# EAGLE design Adafruit VEML6070 (EAGLE 9.4.2)
AUTHOR: KTOWN
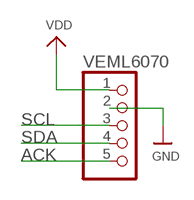
[diagram p0: schematic, sheet 1]

## Parts
VEML6070  HEADER-1X570MIL  [1X05_ROUND_70]

## Nets
ACK: VEML6070.5
GND: VEML6070.2
SCL: VEML6070.3
SDA: VEML6070.4
VDD: VEML6070.1

## Library data of the parts
VEML6070 = microbuilder:HEADER-1X5: PIN HEADER

## Board
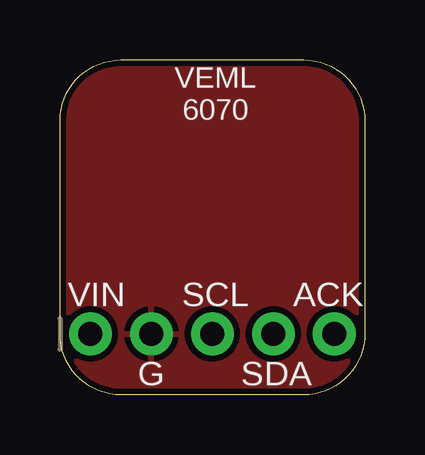
[diagram p1: board, top side]
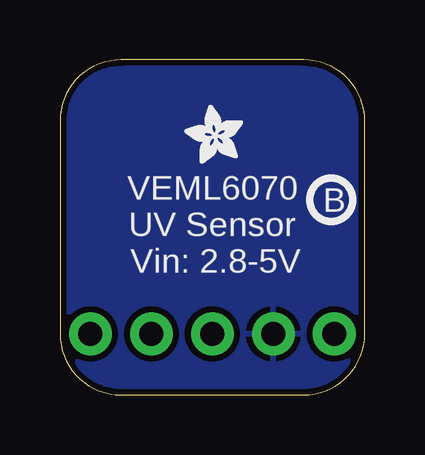
[diagram p2: board, bottom side, seen from below]

Size 12.7 x 13.97 mm. Coordinates in mm from the lower left corner, seen from the top.
Outline: 12.7,11.43 12.7,2.54 arc-90 10.16,0 2.54,0 arc-90 0,2.54 0,11.43 arc-90 2.54,13.97 10.16,13.97 arc-90 12.7,11.43
Copper layers (1*16): Top 0.035mm / dielectric 1.5mm / Bottom 0.035mm
Design rules "adafruit": minimum track width 8mil, minimum drill 15.5mil, track to track 8mil, track to pad 8mil, pad to pad 8mil, via to via 8mil, smd to smd 8mil, copper to edge 10mil, drill to drill 8mil, minimum pad ring 10mil, minimum via ring 8mil, stop-mask expansion 2mil, vias tented up to drill 20mil, thermal gap 10mil

### Footprints (pad centres in the part's own frame; a part is rotated, then mirrored left to right if it is on the bottom)
1X05_ROUND_70 = drill 1 pad 1.778: 1 -5.08,0; 2 -2.54,0; 3 0,0; 4 2.54,0; 5 5.08,0

### Placement (x,y rotation side)
U$2  [PCBFEAT-REV-040]  1.4,8.13 0 bottom
U$14  [ADAFRUIT_2.5MM]  5.08,9.65 90 bottom
VEML6070  6.35,2.54 0 top

### Tracks (layer width: path | path; a pad name or v marks a point on that pad's centre or on a via)
GND
  pour Top (isolate 0.254): 0,0 0,13.97 12.7,13.97 12.7,0
  pour Bottom (isolate 0.254): 0,0 0,13.97 12.7,13.97 12.7,0

### Text on the board
tPlace: VEML / 6070 | VIN | SCL | ACK | G | SDA
bPlace: VEML6070 / UV Sensor | Vin: 2.8-5V